# EAGLE design SimpleEMGCircuit (EAGLE 7.3.0)
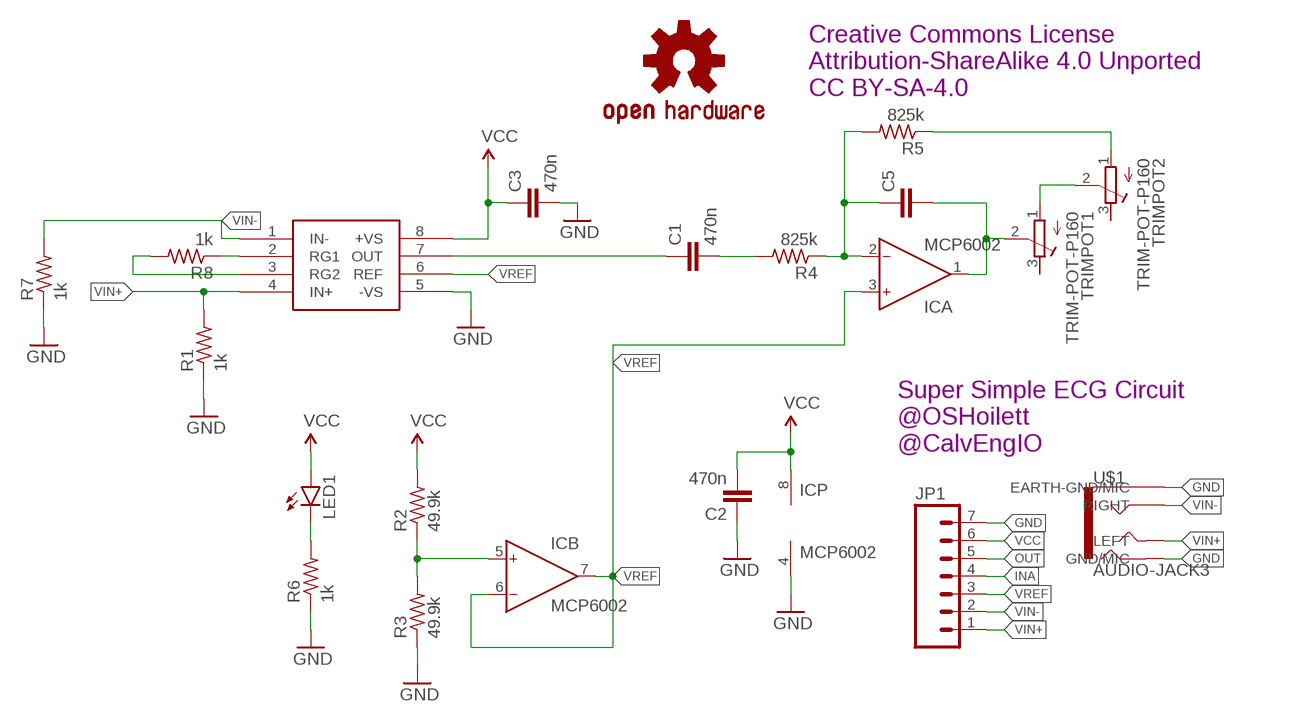
[diagram p0: schematic, sheet 1]

## Parts
C1  470n  C-EUC0402  [C0402]
C2  470n  C-EUC0402  [C0402]
C3  470n  C-EUC0402  [C0402]
C5  C-EU025-024X044  [C025-024X044]
IC  MCP6002  AD8607RM  [MSOP08]
INA  AD8220  [MSOP08]
JP1  M07  [1X07]
LED1  LED0603  [LED-0603]
LOGO1  OSHW-LOGOS  [OSHW-LOGO-S]
R1  1k  R-US_R0402  [R0402]
R2  49.9k  R-US_R0402  [R0402]
R3  49.9k  R-US_R0402  [R0402]
R4  825k  R-US_R0402  [R0402]
R5  825k  R-US_R0402  [R0402]
R6  1k  R-US_R0402  [R0402]
R7  1k  R-US_R0402  [R0402]
R8  1k  R-US_R0402  [R0402]
TRIMPOT1  TRIM-POT-P160  [16MMROTARYPOT]
TRIMPOT2  TRIM-POT-P160  [16MMROTARYPOT]
U$1  AUDIO-JACK3  [AUDIO-JACK-TRRS-SMD]

## Nets
GND: C2.1 C3.2 IC.4(P:V-) INA.5(-VS) JP1.7 R1.1 R3.1 R6.1 R7.1 U$1.EARTH(EARTH-GND/MIC) U$1.RING2(GND/MIC)
INA: C1.1 INA.7(OUT) JP1.4
N$1: TRIMPOT1.1(A) TRIMPOT2.2(S)
N$2: R5.1 TRIMPOT2.1(A)
N$3: IC.5(B:IN+) R2.1 R3.2
N$4: C1.2 R4.2
N$5: C5.1 IC.2(A:IN-) R4.1 R5.2
N$6: LED1.C R6.2
N$7: INA.2(RG1) R8.1
N$8: INA.3(RG2) R8.2
OUT: C5.2 IC.1(A:OUT) JP1.5 TRIMPOT1.2(S)
VCC: C2.2 C3.1 IC.8(P:V+) INA.8(+VS) JP1.6 LED1.A R2.2
VIN+: INA.4(IN+) JP1.1 R1.2 U$1.TIP(LEFT)
VIN-: INA.1(IN-) JP1.2 R7.2 U$1.RING1(RIGHT)
VREF: IC.3(A:IN+) IC.6(B:IN-) IC.7(B:OUT) INA.6(REF) JP1.3
Unconnected: TRIMPOT1.3(E) TRIMPOT2.3(E)

## Notes on the sheet
- Creative Commons License
  Attribution-ShareAlike 4.0 Unported
  CC BY-SA-4.0
- Super Simple ECG Circuit
  @OSHoilett
  @CalvEngIO

## Library data of the parts
C1-C3 C5 = resistor:C-EU: CAPACITOR, European symbol
IC = analog-devices:AD8607: Precision Micropower, Low Noise CMOS, Rail-to-Rail Input/Output Operational Amplifiers Source: http://www.analog.com/static/imported-files/data_sheets/AD8603_8607_8609.pdf; MF: ALTERA CORPORATION; MPN: AD8607ARMZ-REEL; OC_FARNELL: 1464990; OC_NEWARK: 59K6925
INA = Orlando:AD8220
JP1 = SparkFun-Connectors:M07: Header 7 Standard 7-pin 0.1" header. Use with straight break away headers (SKU : PRT-00116), right angle break away headers (PRT-00553), swiss pins (PRT-00743), machine pins (PRT-00117), and female headers (PRT-00115). NOTES ON THE VARIANTS LOCK and LOCK_LONGPADS... This footprint was designed to help hold the alignment of a through-hole component (i.e. 7-pin header) while soldering it into place. You may notice that each hole has been shifted either up or down by 0.005 of an inch from it's more standard position (which is usually a perfectly straight line). This slight alteration caused the pins (the squares in the middle) to touch the edges of the holes. Because they are alternating, it causes a "brace" to hold the header in place. 0.005 has proven to be the perfect amount of "off-center" position when using our standard breakaway headers. Although looks a little odd when you look at the bare footprint, once you have a header in there, the alteration is very hard to notice. Also, if you push a header all the way into place, it is covered up entirely on the bottom side. This idea of altering the position of holes to aid alignment will be further integrated into the Sparkfun Library for other footprints. It can help hold any component with 3 or more connection pins.
LED1 = SparkFun-LED:LED: LEDs Standard schematic elements and footprints for 5mm, 3mm, 1206, and 0603 sized LEDs. 5mm - Spark Fun Electronics SKU : COM-00529 (and others)
LOGO1 = SparkFun-Aesthetics:OSHW-LOGO: Open Source Hardware Logo This logo indicates the piece of hardware it is found on incorporates a OSHW license and/or adheres to the definition of open source hardware found here: http://freedomdefined.org/OSHW
R1-R8 = resistor:R-US_: RESISTOR, American symbol
TRIMPOT1 TRIMPOT2 = Orlando:TRIM-POT-P160
U$1 = SparkFun-Connectors:AUDIO-JACK3: Audio jack - 3.5mm TRRS variety - two rings.

## Board
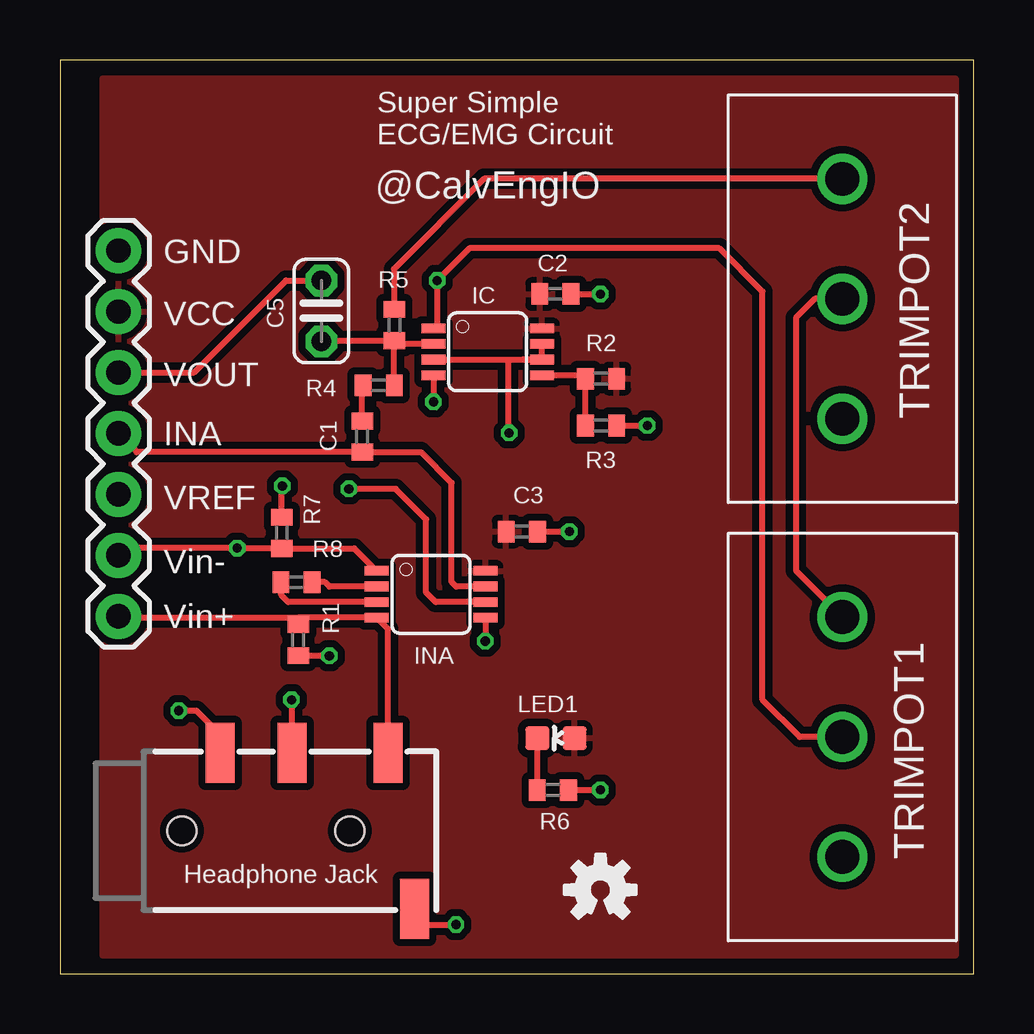
[diagram p1: board, top side]
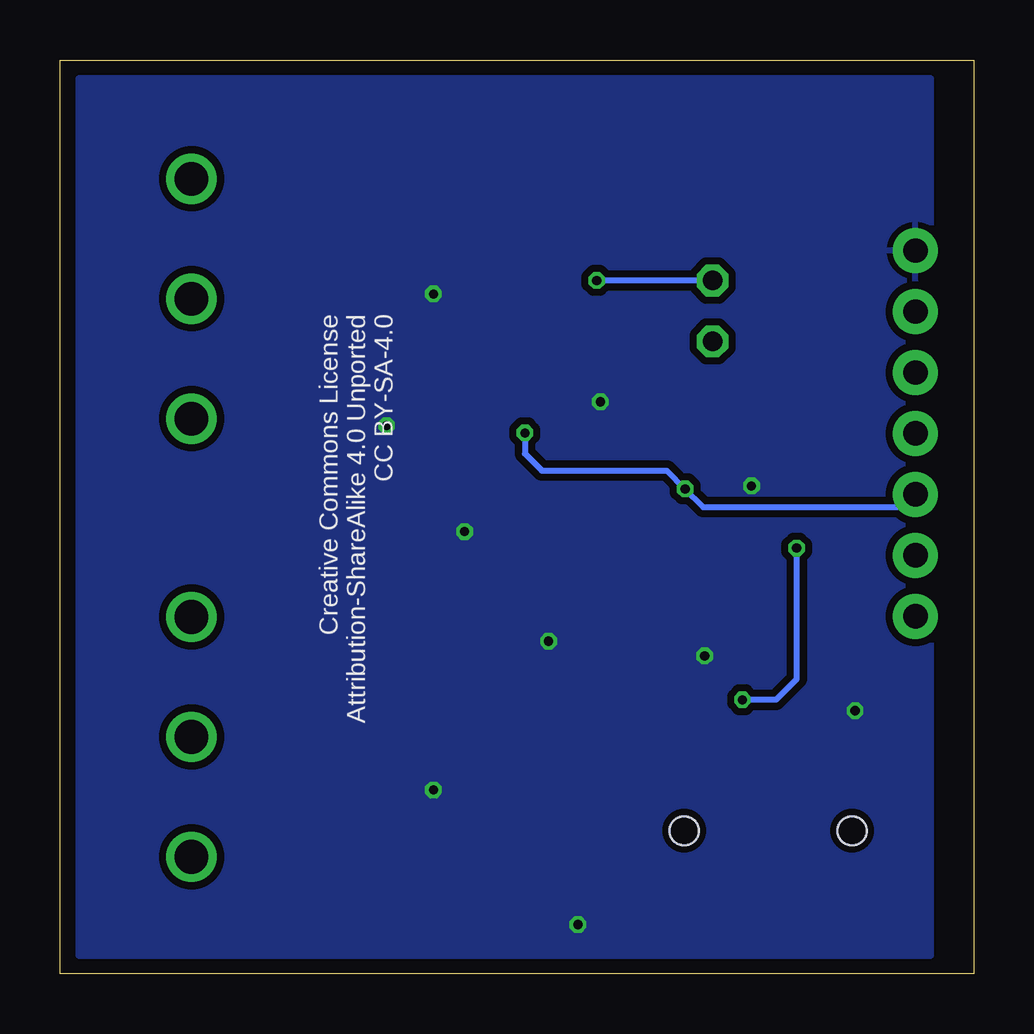
[diagram p2: board, bottom side, seen from below]

Size 38.1 x 38.1 mm. Coordinates in mm from the lower left corner, seen from the top.
Outline: 0,0 38.1,0 38.1,38.1 0,38.1 0,0
Copper layers (1*16): Top 0.035mm / dielectric 1.5mm / Bottom 0.035mm
Design rules "SeeedStudio_2layer_DRU_no_angle_20140221": minimum track width 6mil, minimum drill 12mil, track to track 6mil, track to pad 6mil, pad to pad 6mil, via to via 6mil, smd to smd 0mil, copper to edge 10mil, drill to drill 10mil, minimum pad ring 10mil, minimum via ring 6mil, stop-mask expansion 2mil, vias tented up to drill 100mil, thermal gap 10mil

### Footprints (pad centres in the part's own frame; a part is rotated, then mirrored left to right if it is on the bottom)
C0402 = smd 0.7 x 0.9: 1 -0.65,0; 2 0.65,0
C025-024X044 = drill 0.813 octagon: 1 -1.27,0; 2 1.27,0
MSOP08 = smd 0.4 x 1: 1 -0.976,-2.263; 2 -0.326,-2.263; 3 0.324,-2.263; 4 0.974,-2.263; 5 0.974,2.262; 6 0.324,2.262; 7 -0.326,2.262; 8 -0.976,2.262
1X07 = drill 1.016 pad 1.88: 1 0,0; 2 2.54,0; 3 5.08,0; 4 7.62,0; 5 10.16,0; 6 12.7,0; 7 15.24,0
LED-0603 = smd 1 x 1: A 0,-0.677; C 0,0.877
R0402 = smd 0.7 x 0.9: 1 -0.65,0; 2 0.65,0
16MMROTARYPOT = drill 1.4: 1 -5,0; 2 0,0; 3 5,0
AUDIO-JACK-TRRS-SMD = smd 1.2 x 2.5: EARTH 11.3,-3.25; RING1 6.2,3.25; RING2 3.2,3.25; TIP 10.2,3.25 | hole 1.2: 1.6,0; 8.6,0

### Placement (x,y rotation side)
C1  12.6,22.4 90 top
C2  20.65,28.35 180 top
C3  19.25,18.44 0 top
C5  10.9,27.64 90 top
IC  17.83,25.93 270 top
INA  15.47,15.82 270 top
JP1  2.44,14.91 90 top
LED1  20.78,9.83 90 top
LOGO1  22.53,3.51 0 top
R1  9.93,13.92 90 top
R2  22.56,24.82 0 top
R3  22.56,22.86 180 top
R4  13.28,24.54 180 top
R5  13.94,27.05 270 top
R6  20.55,7.67 180 top
R7  9.25,18.39 270 top
R8  9.86,16.33 180 top
TRIMPOT1  32.61,9.88 270 top
TRIMPOT2  32.61,28.14 270 top
U$1  3.48,5.97 0 top

### Tracks (layer width: path | path; a pad name or v marks a point on that pad's centre or on a via)
GND  (via drill 0.38)
  Top 0.254: IC.4 v15.57,23.85 | C2.1 v22.53,28.35 | R3.1 v24.49,22.86 | U$1.RING2 6.66,9.7 6.66,10.01 5.69,10.97 v4.95,10.97 | U$1.EARTH 15.19,2.06 v16.51,2.06 | R6.1 v22.53,7.67 | R7.1 9.25,20.32 v9.27,20.34 | R1.1 11.22,13.27 v11.23,13.26 | INA.5 v17.73,13.87 | C3.2 v21.23,18.44
  pour Bottom (isolate 0.305): 1.78,37.34 37.34,37.34 37.34,0.76 1.78,0.76
INA
  Top 0.254: INA.7 16.51,16.15 16.33,16.33 16.33,20.47 15.05,21.75 C1.1 3.19,21.75 3.19,21.78 JP1.4
N$1
  Top 0.254: TRIMPOT2.2 31.47,28.14 30.68,27.36 30.68,16.81 TRIMPOT1.1
N$2
  Top 0.254: TRIMPOT2.1 17.68,33.14 13.92,29.39 13.92,27.73 R5.1
N$3
  Top 0.254: IC.5 21.76,24.96 R2.1 | 21.89,24.8 R2.1 | R3.2 R2.1
N$4
  Top 0.254: C1.2 12.6,24.5 R4.2
N$5
  Top 0.254: 15.56,26.25 IC.2 14.09,26.26 R5.2 | R4.1 R5.2 | R5.2 10.92,26.39 C5.1
N$6
  Top 0.254: R6.2 LED1.C
N$7
  Top 0.254: INA.2 11.23,16.15 11.05,16.33 R8.1
N$8
  Top 0.254: 9.22,16.44 R8.2 9.22,16.32 9.22,15.8 9.52,15.5 INA.3
OUT  (via drill 0.38)
  Top 0.254: TRIMPOT1.2 30.84,9.88 29.29,11.43 29.29,28.45 27.48,30.25 17.07,30.25 v15.72,28.91 15.72,27.06 IC.1 | JP1.5 5.59,25.07 9.42,28.91 C5.2
  Bottom 0.254: C5.2 v15.72,28.91
VCC
  pour Top (isolate 0.305): 1.78,37.34 37.34,37.34 37.34,0.76 1.78,0.76
VIN+
  Top 0.254: JP1.1 2.5,14.85 9.93,14.85 | 9.93,14.85 INA.4 13.68,14.38 U$1.TIP | R1.2 9.93,14.85
VIN-  (via drill 0.38)
  Top 0.254: 2.73,17.74 JP1.2 2.74,17.75 v7.39,17.75 9.23,17.75 R7.2 12.27,17.74 INA.1 | U$1.RING1 9.68,11.4 v9.65,11.43
  Bottom 0.254: v7.39,17.75 7.39,12.29 8.26,11.43 v9.65,11.43
VREF  (via drill 0.38)
  Top 0.254: IC.6 IC.7 | IC.6 19.26,25.61 | v18.72,22.55 18.67,22.61 18.67,25.53 18.75,25.61 | IC.3 18.75,25.61 | 18.75,25.61 IC.6 | INA.6 15.67,15.5 15.27,15.9 15.27,18.95 13.99,20.22 v12.04,20.22
  Bottom 0.254: v18.72,22.55 18.72,21.69 18.01,20.98 12.8,20.98 v12.04,20.22 11.28,19.46 2.95,19.46 2.95,19.48 JP1.3

### Text on the board
tNames: Super Simple / ECG/EMG Circuit | @CalvEngIO | GND | VCC | VOUT | INA | VREF | Vin- | Vin+ | Headphone Jack
_bsilk: Creative Commons License / Attribution-ShareAlike 4.0 Unported / CC BY-SA-4.0